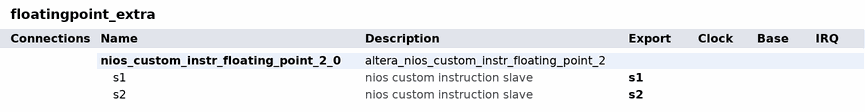
[diagram p0: system contents]
# Platform Designer (Qsys) system floatingpoint_extra, Cyclone V 5CSEMA5F31C6
# Parameters at their usual value, and those the tool derives, are not listed.
package require -exact qsys 17.0
create_system floatingpoint_extra
set_project_property DEVICE_FAMILY {Cyclone V}
set_project_property DEVICE 5CSEMA5F31C6

add_instance nios_custom_instr_floating_point_2_0 altera_nios_custom_instr_floating_point_2 17.0
set_instance_property nios_custom_instr_floating_point_2_0 AUTO_EXPORT true
set_instance_parameter_value nios_custom_instr_floating_point_2_0 arithmetic_present false
set_instance_parameter_value nios_custom_instr_floating_point_2_0 comparison_present false
set_instance_parameter_value nios_custom_instr_floating_point_2_0 conversion_present true
set_instance_parameter_value nios_custom_instr_floating_point_2_0 root_present false

# exported interfaces
add_interface s1 nios_custom_instruction end
set_interface_property s1 EXPORT_OF nios_custom_instr_floating_point_2_0.s1
add_interface s2 nios_custom_instruction end
set_interface_property s2 EXPORT_OF nios_custom_instr_floating_point_2_0.s2

set_interconnect_requirement {$system} qsys_mm.clockCrossingAdapter HANDSHAKE
set_interconnect_requirement {$system} qsys_mm.enableEccProtection FALSE
set_interconnect_requirement {$system} qsys_mm.insertDefaultSlave FALSE
set_interconnect_requirement {$system} qsys_mm.maxAdditionalLatency 1

save_system floatingpoint_extra.qsys
